# Altium schematic sheet signal_conditioning_sims1.SchDoc: Signal conditioning simulations. 1 of 2
size A4; SheetNumber: 17; SheetTotal: 21; TitleBig: Signal conditioning circuit simulations; Desc_line1: SPICE simulations of the adequation circuit. These are only the results. You can find the simulation circuit and models; Desc_line2: on the ./SIMULATIONS/ folder inside this project.
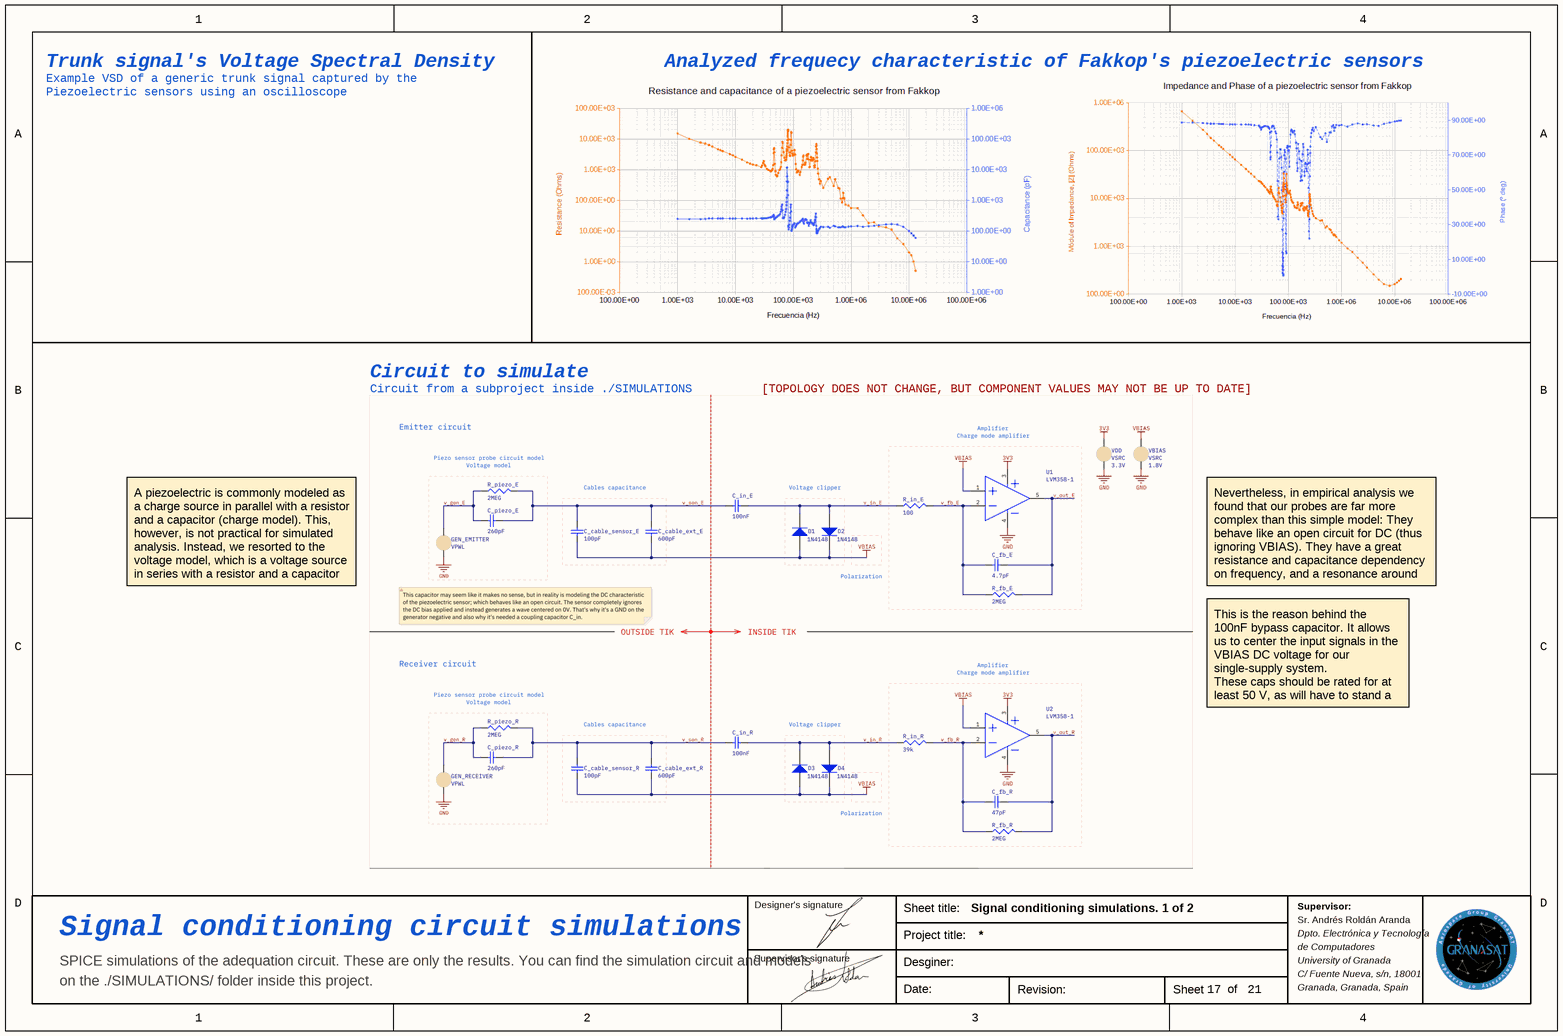
[diagram p0: signal_conditioning_sims1.SchDoc]

## Notes on the sheet
- Trunk signal's Voltage Spectral Density
- Example VSD of a generic trunk signal captured by the
- Piezoelectric sensors using an oscilloscope
- Analyzed frequecy characteristic of Fakkop's piezoelectric sensors
- Circuit to simulate
- Circuit from a subproject inside ./SIMULATIONS
- [TOPOLOGY DOES NOT CHANGE, BUT COMPONENT VALUES MAY NOT BE UP TO DATE]
- A piezoelectric is commonly modeled as a charge source in parallel with a resistor and a capacitor (charge model). This, however, is not practical for simulated analysis. Instead, we resorted to the voltage model, which is a voltage source in series with a resistor and a capacitor in parallel.
- Nevertheless, in empirical analysis we found that our probes are far more complex than this simple model: They behave like an open circuit for DC (thus ignoring VBIAS). They have a great resistance and capacitance dependency on frequency, and a resonance around 100 kHz.
- This is the reason behind the 100nF bypass capacitor. It allows us to center the input signals in the VBIAS DC voltage for our single-supply system.
  These caps should be rated for at least 50 V, as will have to stand a big voltage peak on their extremes.
- Designer's signature
- Sheet title:
- Sr. Andrés Roldán Aranda
- Supervisor:
- Supervisor's signature
- Project title:
- Desginer:
- Dpto. Electrónica y Tecnología
- de Computadores
- University of Granada
- C/ Fuente Nueva, s/n, 18001
- Granada, Granada, Spain
- Date:
- Revision:
- Sheet
- of